# EAGLE board Pinscape Pico Expansion Board - DIY Friendly Main (EAGLE 7.7.0)
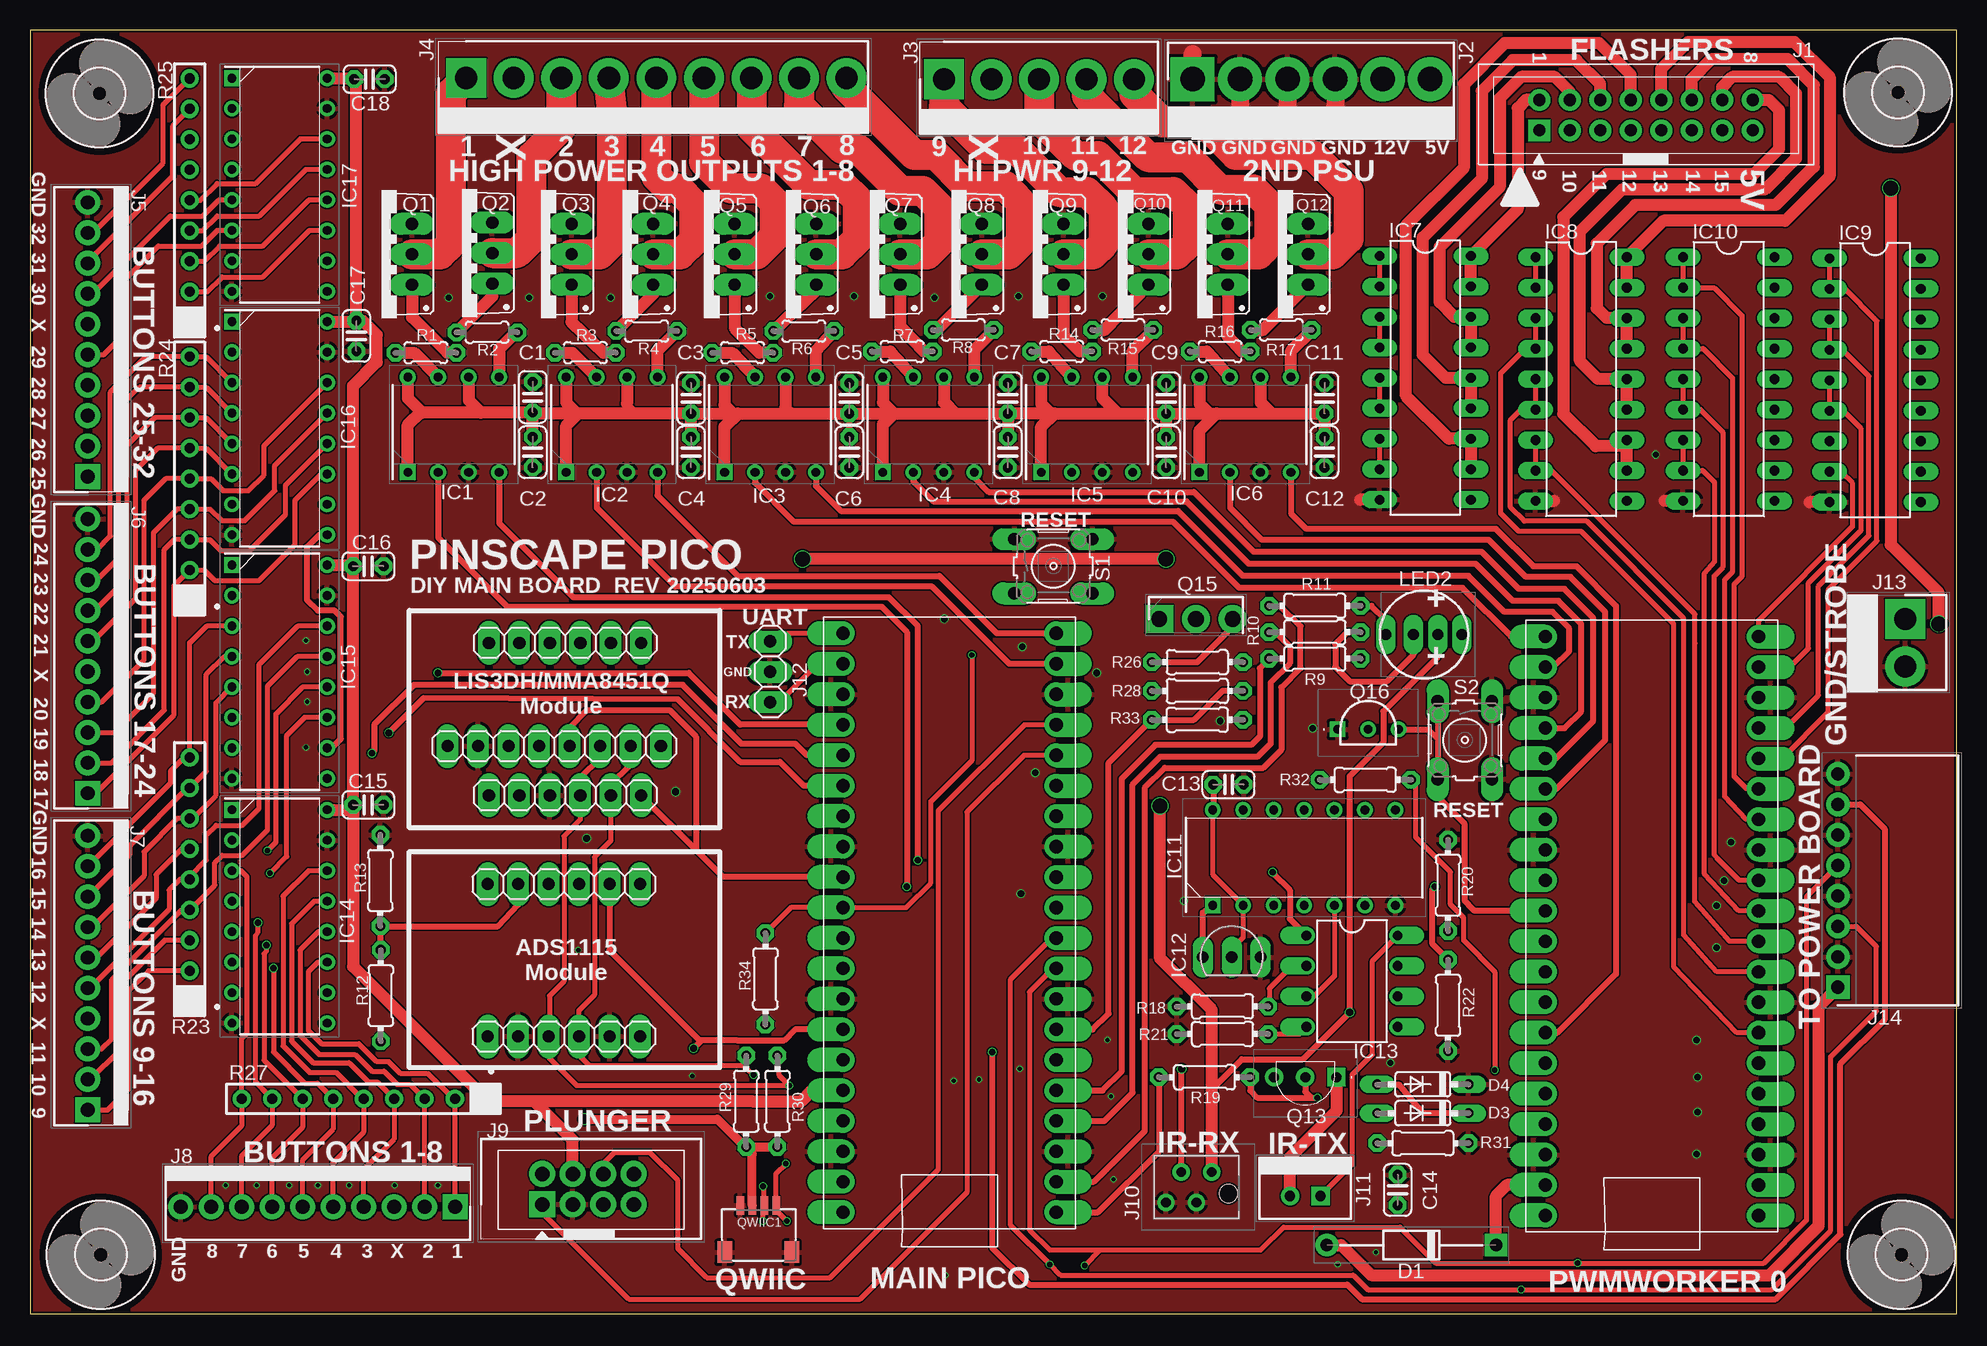
[diagram p11: board, top side]
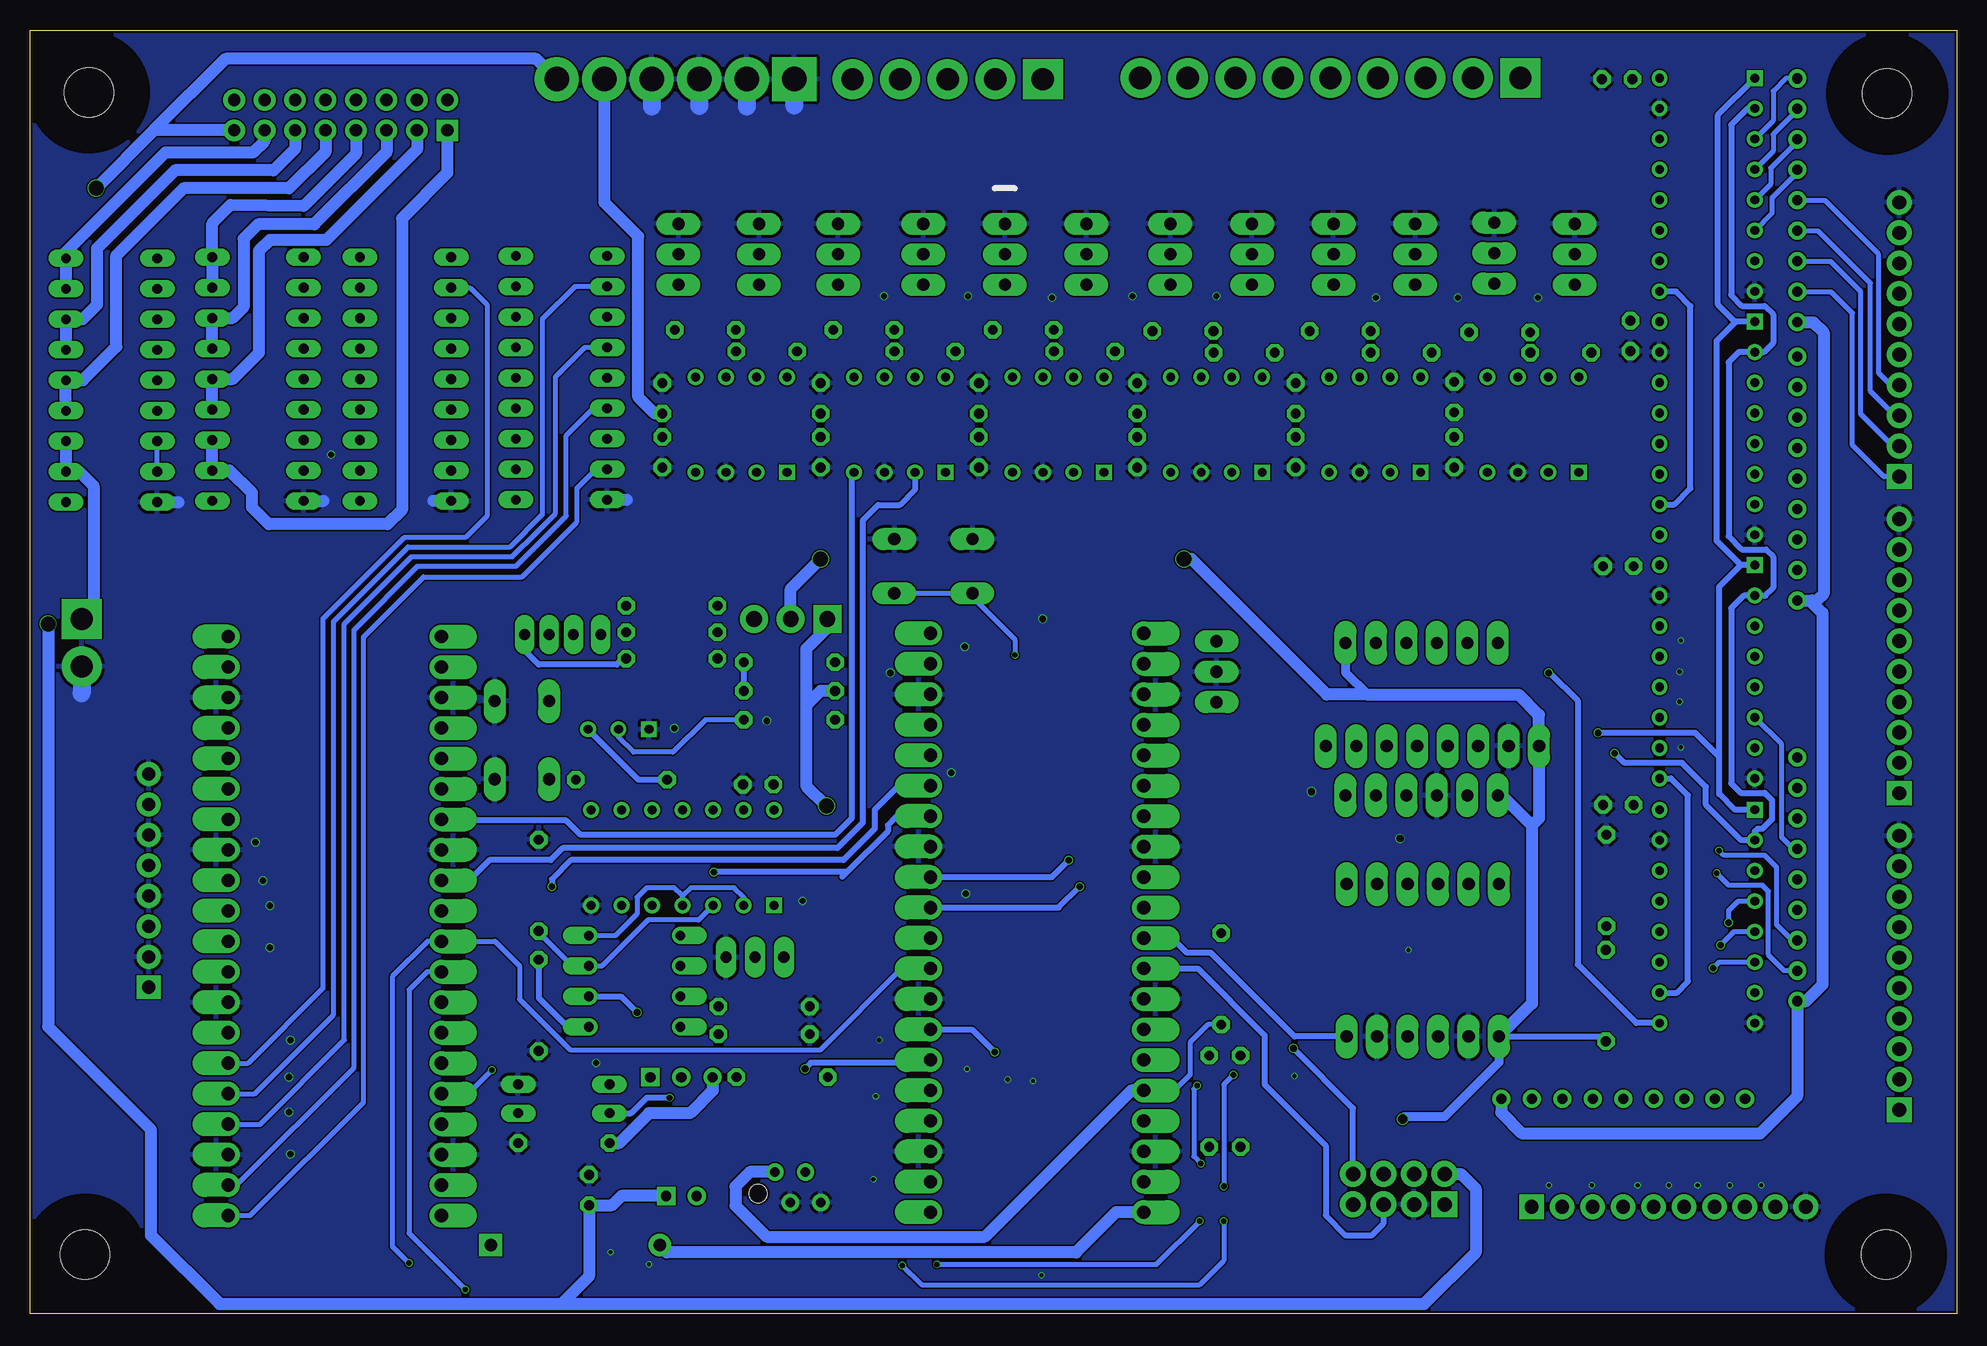
[diagram p12: board, bottom side, seen from below]

Size 160.6 x 107 mm. Coordinates in mm from the lower left corner, seen from the top.
Outline: 0,0 160.6,0 160.6,107 0,107 0,0
Copper layers (1*16): Top 0.035mm / dielectric 1.6mm / Bottom 0.035mm
Design rules "jlcpcb-2layers": minimum track width 5mil, minimum drill 0.3mm, track to track 5mil, track to pad 5mil, pad to pad 5mil, via to via 5mil, smd to smd 5mil, copper to edge 0.2mm, drill to drill 6mil, minimum pad ring 10mil, minimum via ring 3mil, stop-mask expansion 4mil, vias tented up to drill 0mil, thermal gap 10mil
Net classes: 1 highpower: width 0.305 mm, drill 0.483 mm

## Footprints (pad centres in the part's own frame; a part is rotated, then mirrored left to right if it is on the bottom)
C025-024X044 = drill 0.813 octagon: 1 -1.27,0; 2 1.27,0
DIOAD1408W86L464D236 = drill 1.05 pad 1.575 square: 1 0,0 | drill 1.05 pad 1.575: 2 14.1,0
DO35-7 = drill 0.813 long: A 3.81,0; C -3.81,0
DIP794W53P254L959H508Q8N = drill 0.73 pad 1.13 square: 1 -3.97,3.81 | drill 0.73 pad 1.13: 2 -3.97,1.27; 3 -3.97,-1.27; 4 -3.97,-3.81; 5 3.97,-3.81; 6 3.97,-1.27; 7 3.97,1.27; 8 3.97,3.81
DIL18 = drill 0.813 long: 1 -10.16,-3.81; 2 -7.62,-3.81; 3 -5.08,-3.81; 4 -2.54,-3.81; 5 0,-3.81; 6 2.54,-3.81; 7 5.08,-3.81; 8 7.62,-3.81; 9 10.16,-3.81; 10 10.16,3.81; 11 7.62,3.81; 12 5.08,3.81; 13 2.54,3.81; 14 0,3.81; 15 -2.54,3.81; 16 -5.08,3.81; 17 -7.62,3.81; 18 -10.16,3.81
DIP794W53P254L1930H508Q14N = drill 0.73 pad 1.13 square: 1 -3.97,7.62 | drill 0.73 pad 1.13: 2 -3.97,5.08; 3 -3.97,2.54; 4 -3.97,0; 5 -3.97,-2.54; 6 -3.97,-5.08; 7 -3.97,-7.62; 8 3.97,-7.62; 9 3.97,-5.08; 10 3.97,-2.54; 11 3.97,0; 12 3.97,2.54; 13 3.97,5.08; 14 3.97,7.62
TO-92_(TO-226) = drill 0.94 pad 1.118 long: 1 1.143,0; 2 -1.27,0; 3 -3.683,0
DIL08 = drill 0.813 offset: 1 -3.81,-3.81; 2 -1.27,-3.81; 3 1.27,-3.81; 4 3.81,-3.81; 5 3.81,3.81; 6 1.27,3.81; 7 -1.27,3.81; 8 -3.81,3.81
DIP794W53P254L1930H508Q16N = drill 0.73 pad 1.13 square: 1 -3.97,8.89 | drill 0.73 pad 1.13: 2 -3.97,6.35; 3 -3.97,3.81; 4 -3.97,1.27; 5 -3.97,-1.27; 6 -3.97,-3.81; 7 -3.97,-6.35; 8 -3.97,-8.89; 9 3.97,-8.89; 10 3.97,-6.35; 11 3.97,-3.81; 12 3.97,-1.27; 13 3.97,1.27; 14 3.97,3.81; 15 3.97,6.35; 16 3.97,8.89
3M-30316-6002HB-ROTATED = drill 1.01 pad 1.51: 1 -8.89,-1.27; 2 -8.89,1.27; 3 -6.35,-1.27; 4 -6.35,1.27; 5 -3.81,-1.27; 6 -3.81,1.27; 7 -1.27,-1.27; 8 -1.27,1.27; 9 1.27,-1.27; 10 1.27,1.27; 11 3.81,-1.27; 12 3.81,1.27; 13 6.35,-1.27; 14 6.35,1.27; 15 8.89,-1.27 | drill 1.01 pad 1.51 square: 16 8.89,1.27
SHDR6W183P0X396_1X6_2377X762X1 = drill 2.05 pad 3.075 square: 1 0,0 | drill 2.05 pad 3.075: 2 3.96,0; 3 7.92,0; 4 11.88,0; 5 15.84,0; 6 19.8,0
HDRV5W117P0X396_1X5_1981X762X1 = drill 1.85 pad 2.775 square: 1 7.92,0 | drill 1.85 pad 2.775: 2 3.958,0; 3 -0.004,0; 4 -3.966,0; 5 -7.928,0
SHDR9W117P0X396_1X9_3566X762X1 = drill 1.85 pad 2.775 square: 1 15.84,0 | drill 1.85 pad 2.775: 2 11.878,0; 3 7.916,0; 4 3.954,0; 5 -0.008,0; 6 -3.97,0; 7 -7.932,0; 8 -11.894,0; 9 -15.856,0
SHDR10W66P0X254_1X10_2540X572X = drill 1.15 pad 1.725 square: 1 11.43,0 | drill 1.15 pad 1.725: 2 8.89,0; 3 6.35,0; 4 3.81,0; 5 1.27,0; 6 -1.27,0; 7 -3.81,0; 8 -6.35,0; 9 -8.89,0; 10 -11.43,0
SHDR8W69P254_2X4_1780X878X955P = drill 1.2 pad 1.8 square: 1 0,0 | drill 1.2 pad 1.8: 2 0,2.54; 3 2.54,0; 4 2.54,2.54; 5 5.08,0; 6 5.08,2.54; 7 7.62,0; 8 7.62,2.54
2150794 = drill 0.8 pad 1.3: 1 0,0; 2 -1.27,-2.54; 3 -2.54,0; 4 -3.81,-2.54 | hole 1.5: 1.4,-1.8
HDRV2W66P0X254_1X2_762X572X100 = drill 0.85 pad 1.275 square: 1 1.27,0 | drill 0.85 pad 1.275: 2 -1.27,0
1X03 = drill 1.016 long: 1 -2.54,0; 2 0,0; 3 2.54,0
SHDR2W117P0X396_1X2_792X762X11 = drill 1.85 pad 2.775 square: 1 0,0 | drill 1.85 pad 2.775: 2 3.962,0
RHDRRA8W64P254_1X8_2083X851X24 = drill 1.1 pad 1.65 square: 1 0,0 | drill 1.1 pad 1.65: 2 -2.54,0; 3 -5.08,0; 4 -7.62,0; 5 -10.16,0; 6 -12.7,0; 7 -15.24,0; 8 -17.78,0
1X06 = drill 1.016 long: 1 -6.35,0; 2 -3.81,0; 3 -1.27,0; 4 1.27,0; 5 3.81,0; 6 6.35,0
1X08 = drill 1.016 long: 1 -8.89,0; 2 -6.35,0; 3 -3.81,0; 4 -1.27,0; 5 1.27,0; 6 3.81,0; 7 6.35,0; 8 8.89,0
5218559F = drill 0.91 pad 1.016 long: 1 0,1.27; 2 0,-0.762; 3 0,-2.794; 4 0,-5.08
RPI_PICO_TH_NO_DEBUG = drill 1.1 pad 1.6 offset: 3V3 8.89,13.97; 3V3_EN 8.89,16.51; ADC_VREF 8.89,11.43; AGND 8.89,6.35; GND@1 -8.89,19.05; GND@2 -8.89,6.35; GND@3 -8.89,-6.35; GND@4 -8.89,-19.05; GND@6 8.89,-19.05; GND@7 8.89,-6.35; GND@8 8.89,19.05; GP0 -8.89,24.13; GP1 -8.89,21.59; GP2 -8.89,16.51; GP3 -8.89,13.97; GP4 -8.89,11.43; GP5 -8.89,8.89; GP6 -8.89,3.81; GP7 -8.89,1.27; GP8 -8.89,-1.27; GP9 -8.89,-3.81; GP10 -8.89,-8.89; GP11 -8.89,-11.43; GP12 -8.89,-13.97; GP13 -8.89,-16.51; GP14 -8.89,-21.59; GP15 -8.89,-24.13; GP16 8.89,-24.13; GP17 8.89,-21.59; GP18 8.89,-16.51; GP19 8.89,-13.97; GP20 8.89,-11.43; GP21 8.89,-8.89; GP22 8.89,-3.81; GP26_A0 8.89,1.27; GP27_A1 8.89,3.81; GP28_A2 8.89,8.89; RUN 8.89,-1.27; VBUS 8.89,24.13; VSYS 8.89,21.59
TO220BV = drill 1.016 long: 1 -2.54,-2.54; 2 0,-2.54; 3 2.54,-2.54
BC33725 = drill 0.85 pad 1.381 square: 1 0,0 | drill 0.85 pad 1.381: 2 2.6,0; 3 5.2,0
TO229P300X760X1364-3P = drill 1.3 pad 1.95 square: 1 -0.762,0 | drill 1.3 pad 1.95: 2 2.29,0; 3 5.342,0
2N2222A = drill 0.72 pad 1.234 square: 1 0,0 | drill 0.72 pad 1.234: 2 2.54,0; 3 5.08,0
JST_SH4 = smd 0.6 x 1.55: 1 -1.5,2.514; 2 -0.5,2.514; 3 0.5,2.514; 4 1.5,2.514 | smd 1.2 x 1.8: MT1 -2.8,-1.386; MT2 2.8,-1.386
0204/5 = drill 0.813 pad 1.333 octagon: 1 -2.54,0; 2 2.54,0
0204/7 = drill 0.813 octagon: 1 -3.81,0; 2 3.81,0
4609X = drill 0.84 pad 1.34: 1 -10.16,0; 2 -7.62,0; 3 -5.08,0; 4 -2.54,0; 5 0,0; 6 2.54,0; 7 5.08,0; 8 7.62,0; 9 10.16,0
B3F-10XX = drill 1.016 long: 1 -3.251,2.261; 2 3.251,2.261; 3 -3.251,-2.261; 4 3.251,-2.261
4,1 = hole 4.1: 0,0

## Placement (x,y rotation side)
C1  100nF  [C025-024X044]  41.9,76.4 270 top
C2  4.7uF  [C025-024X044]  41.9,71.8 90 top
C3  100nF  [C025-024X044]  55.1,76.3 270 top
C4  4.7uF  [C025-024X044]  55.1,71.8 90 top
C5  100nF  [C025-024X044]  68.3,76.3 270 top
C6  4.7uF  [C025-024X044]  68.3,71.8 90 top
C7  100nF  [C025-024X044]  81.5,76.3 270 top
C8  4.7uF  [C025-024X044]  81.5,71.8 90 top
C9  100nF  [C025-024X044]  94.7,76.3 270 top
C10  4.7uF  [C025-024X044]  94.7,71.8 90 top
C11  100nF  [C025-024X044]  107.9,76.3 270 top
C12  4.7uF  [C025-024X044]  107.9,71.8 90 top
C13  100nF  [C025-024X044]  99.9,44.1 0 top
C14  4.7uF  [C025-024X044]  114,10.3 90 top
C15  100nF  [C025-024X044]  28.2,42.4 180 top
C16  100nF  [C025-024X044]  28.2,62.3 180 top
C17  100nF  [C025-024X044]  27.2,81.5 90 top
C18  100nF  [C025-024X044]  28.3,102.9 180 top
D1  SB140-T  [DIOAD1408W86L464D236]  122.2,5.7 180 top
D3  1N4148  [DO35-7]  116.1,16.7 180 top
D4  1N4148  [DO35-7]  116.1,19.1 180 top
IC1  UCC27524P  [DIP794W53P254L959H508Q8N]  35.3,74.1 90 top
IC2  UCC27524P  [DIP794W53P254L959H508Q8N]  48.5,74.1 90 top
IC3  UCC27524P  [DIP794W53P254L959H508Q8N]  61.7,74.1 90 top
IC4  UCC27524P  [DIP794W53P254L959H508Q8N]  74.9,74.1 90 top
IC5  UCC27524P  [DIP794W53P254L959H508Q8N]  88.1,74.1 90 top
IC6  UCC27524P  [DIP794W53P254L959H508Q8N]  101.3,74.1 90 top
IC7  ULN2803A  [DIL18]  116.3,78 270 top
IC8  ULN2803A  [DIL18]  129.3,77.9 270 top
IC9  ULN2803A  [DIL18]  153.8,77.8 270 top
IC10  ULN2803A  [DIL18]  141.6,77.9 270 top
IC11  SN74HC74NE4  [DIP794W53P254L1930H508Q14N]  106.2,38 90 top
IC12  S-80833CLY  [TO-92_(TO-226)]  98.9,29.7 180 top
IC13  PC827  [DIL08]  110.2,27.7 270 top
IC14  SN74HC165N  [DIP794W53P254L1930H508Q16N]  20.8,33.1 0 top
IC15  SN74HC165N  [DIP794W53P254L1930H508Q16N]  20.8,53.5 0 top
IC16  SN74HC165N  [DIP794W53P254L1930H508Q16N]  20.8,73.8 0 top
IC17  SN74HC165N  [DIP794W53P254L1930H508Q16N]  20.8,94.1 0 top
J1  30316-6002HBROTATED  [3M-30316-6002HB-ROTATED]  134.7,99.9 180 top
J2  640445-6  [SHDR6W183P0X396_1X6_2377X762X1]  96.9,102.9 0 top
J3  640445-5  [HDRV5W117P0X396_1X5_1981X762X1]  84.1,102.9 180 top
J4  640445-9  [SHDR9W117P0X396_1X9_3566X762X1]  52.2,103 180 top
J5  1-640456-0  [SHDR10W66P0X254_1X10_2540X572X]  4.8,81.2 270 top
J6  1-640456-0  [SHDR10W66P0X254_1X10_2540X572X]  4.8,54.8 270 top
J7  1-640456-0  [SHDR10W66P0X254_1X10_2540X572X]  4.8,28.4 270 top
J8  1-640456-0  [SHDR10W66P0X254_1X10_2540X572X]  24,8.9 0 top
J9  30308-6002HB  [SHDR8W69P254_2X4_1780X878X955P]  42.7,9.1 0 top
J10  215079-4  [2150794]  98.5,11.8 0 top
J11  640454-2  [HDRV2W66P0X254_1X2_762X572X100]  106.3,9.8 0 top
J12  [1X03]  61.7,53.5 270 top
J13  640445-2  [SHDR2W117P0X396_1X2_792X762X11]  156.3,57.9 270 top
J14  SSQ-108-02-T-S-RA  [RHDRRA8W64P254_1X8_2083X851X24]  150.7,27.2 270 top
JP1  [1X06]  44.6,55.9 0 top
JP2  [1X06]  44.6,43.2 0 top
JP3  [1X06]  44.5,35.8 0 top
JP4  [1X06]  44.5,23.1 0 top
JP5  [1X08]  43.7,47.3 0 top
LED2  521-8559F  [5218559F]  118.1,56.6 270 top
PICO1  [RPI_PICO_TH_NO_DEBUG]  76.65,32.57 180 top
PICO2  [RPI_PICO_TH_NO_DEBUG]  135.2,32.3 180 top
Q1  STP19NF20  [TO220BV]  29.3,88.3 90 top
Q2  FDPF085N10A  [TO220BV]  36,88.4 90 top
Q3  STP19NF20  [TO220BV]  42.6,88.3 90 top
Q4  STP19NF20  [TO220BV]  49.4,88.3 90 top
Q5  STP19NF20  [TO220BV]  56.2,88.3 90 top
Q6  STP19NF20  [TO220BV]  63,88.3 90 top
Q7  STP19NF20  [TO220BV]  70,88.3 90 top
Q8  STP19NF20  [TO220BV]  76.8,88.3 90 top
Q9  STP19NF20  [TO220BV]  83.6,88.3 90 top
Q10  STP19NF20  [TO220BV]  90.7,88.3 90 top
Q11  STP19NF20  [TO220BV]  97.3,88.3 90 top
Q12  STP19NF20  [TO220BV]  104,88.3 90 top
Q13  BC337-25  [BC33725]  108.9,19.7 180 top
Q15  2N5195G  [TO229P300X760X1364-3P]  94.9,57.9 0 top
Q16  2N2222A  [2N2222A]  109,48.7 0 top
QWIIC1  QWIIC  [JST_SH4]  60.7,6.5 0 top
R1  200R  [0204/5]  33,80.1 0 top
R2  200R  [0204/5]  38.1,81.8 180 top
R3  200R  [0204/5]  46.3,80.1 0 top
R4  200R  [0204/5]  51.4,81.9 180 top
R5  200R  [0204/5]  59.4,80.1 0 top
R6  200R  [0204/5]  64.5,81.9 180 top
R7  200R  [0204/5]  72.7,80.2 0 top
R8  200R  [0204/5]  77.8,82 180 top
R9  100R  [0204/7]  107.1,54.6 0 top
R10  10R  [0204/7]  107.1,56.8 0 top
R11  10R  [0204/7]  107.1,59 0 top
R12  10K  [0204/7]  29.24,26.5 270 top
R13  10K  [0204/7]  29.2,36.1 270 top
R14  200R  [0204/5]  86,80.2 0 top
R15  200R  [0204/5]  91.1,82 180 top
R16  200R  [0204/5]  99.2,80.2 0 top
R17  200R  [0204/5]  104.3,82 180 top
R18  240R  [0204/7]  99.4,25.6 0 top
R19  540R  [0204/7]  97.9,19.7 0 top
R20  10K  [0204/7]  118.2,35.7 90 top
R21  360R  [0204/7]  99.4,23.3 0 top
R22  10K  [0204/7]  118.2,25.7 90 top
R23  4609X-101-103F  [4609X]  13.3,36.2 90 top
R24  4609X-101-103F  [4609X]  13.3,69.6 90 top
R25  4609X-101-103F  [4609X]  13.3,92.8 90 top
R26  1K  [0204/7]  97.3,54.3 180 top
R27  4609X-101-103F  [4609X]  27.8,17.9 180 top
R28  22K  [0204/7]  97.3,51.9 180 top
R29  15K  [0204/7]  59.7,17.7 270 top
R30  15K  [0204/7]  62.3,17.7 270 top
R31  2R5  [0204/7]  116.1,14.2 180 top
R32  4.7K  [0204/7]  111.3,44.5 0 top
R33  2.2k  [0204/7]  97.3,49.5 0 top
R34  4.7K  [0204/7]  61.3,27.9 270 top
S1  B3F-1000  [B3F-10XX]  85.3,62.3 0 top
S2  B3F-1000  [B3F-10XX]  119.6,47.8 270 top
U$1  [4,1]  5.8,101.7 0 top
U$2  [4,1]  155.7,101.8 0 top
U$3  [4,1]  156,4.9 0 top
U$4  [4,1]  5.9,4.9 0 top

## Tracks (layer width: path | path; a pad name or v marks a point on that pad's centre or on a via)
3V3_PERIPHERAL  (via drill 0.8, 1.25)
  Top 0.5: R29.2 59.65,13.85
  Top 0.75: v46.2,16.2 57.3,16.2 59.65,13.85 60.2,13.3 QWIIC1.2 | R29.2 R30.2
  Top 1: v94.7,62.9 v64.4,62.9
  Bottom 0.5: JP4.1 29.65,23.1 R12.2
  Bottom 0.75: JP4.1 38.15,20.95 42.7,16.4 46,16.4 v46.2,16.2 | JP1.6 50.95,53.45 49.1,51.6
  Bottom 1: JP2.1 37.9,43.2 35.4,40.7 | 35.4,40.7 35.4,25.85 JP4.1 | Q15.2 97.19,60.41 v94.7,62.9 | v64.4,62.9 63.8,62.9 52.5,51.6 49.1,51.6 36.5,51.6 34.81,49.91 JP5.1 34.81,41.29 35.4,40.7
3V3_PICO  (via drill 0.6, 1.25)
  Top 0.4: 60.2,17.7 59.8,17.7
  Top 0.5: 98.5,18.7 101,21.2 106.1,21.2 v110,25.1 110,44.8 112.8,47.6 112.8,50.2 117.34,54.74 LED2.2 | C17.2 27.73,82.77
  Top 1: 42,17.7 60.2,17.7 64.3,17.7 65.2,18.6 PICO1.3V3 | 42,17.7 38.16,17.7 R27.1 26.93,28.93 C15.2 | IC14.16 26.78,41.99 C15.2 | J10.1 98.5,18.7 98.5,25.3 94.2,29.6 v94.2,42.3 | J9.4 45.24,14.46 42,17.7 | IC15.16 26.78,62.39 C16.2 | C16.2 26.93,77.33 28.9,79.3 28.9,81.6 27.73,82.77 | IC16.16 27.12,82.69 C17.2 27.2,102.73 C18.2 27.08,102.99 IC17.16 | C15.2 C16.2
  Bottom 0.4: R34.2 62.41,24.09 63.9,22.6 63.9,19.9 65.2,18.6 PICO1.3V3
  Bottom 0.5: IC13.6 111.33,26.43 v110,25.1
  Bottom 1: R27.1 37.96,16.76 36.2,15 16.4,15 13.3,18.1 R23.1 12.56,26.04 11.2,27.4 11.2,58.4 12.07,59.27 12.07,59.44 | R25.1 11.94,82.64 11.1,81.8 11.1,60 11.66,59.44 12.07,59.44 | R24.1 12.07,59.44 | Q15.1 94.2,57.84 94.2,57.1 95.9,55.4 95.9,50.7 | 95.9,50.7 95.9,44 v94.2,42.3 | R28.2 94.7,51.9 95.9,50.7 | J10.1 100.6,11.8 101.8,10.6 101.8,9 99.2,6.4 81,6.4 68.8,18.6 PICO1.3V3
5V  (via drill 1.25)
  Top 0.4: IC11.14 98.58,36.62 101.12,34.08 IC11.2 101.12,31.32 100.17,30.37 IC12.2 | IC13.8 111.9,29.4 111.9,21.6 110.2,19.9 110.2,12.43 J11.1
  Top 0.5: C13.1 98.63,42.02 IC11.14
  Top 1: v155.1,93.8 155.1,64.1 159.1,60.1 v159.1,57.5
  Bottom 0.4: 106.2,34.8 106.9,35.5 109.2,35.5 110,34.7 110,33.3 111.79,31.51 IC13.8 | IC11.4 106.2,34.8 | IC11.2 101.12,34.72 101.9,35.5 105.5,35.5 106.2,34.8
  Bottom 1: J1.2 150.27,98.63 | v159.1,57.5 159.1,23.9 150.5,15.3 150.5,6.5 144.8,0.8 116.3,0.8 | J9.2 41.34,11.64 40.1,10.4 40.1,5.1 44.4,0.8 116.3,0.8 | 150.27,98.63 v155.1,93.8 | J11.1 111.3,9.8 112.07,9.03 C14.1 114,3.1 116.3,0.8 | 150.27,98.63 144.3,104.6 118.4,104.6 J2.6
12V
  Top 0.406: 41.87,75.1 C1.2 | 41.87,73.1 C2.2
  Top 0.5: 32.69,75.1 32.59,75.19 | 45.7,75.03 45.6,75.03 | 42,75.03 C1.2 | 49.77,75.86 50.6,75.03 | 58.6,75.03 59,75.03 | C6.2 C5.2 | 62.97,75.56 63.5,75.03
  Top 1: IC1.8 31.49,76.3 32.59,75.19 31.49,74.09 IC1.1 | 37.6,75.1 41.87,75.1 41.87,73.1 | 37.6,75.1 32.69,75.1 | C3.2 50.6,75.03 45.7,75.03 44.69,74.02 IC2.1 | 42,75.03 45.6,75.03 44.69,75.94 IC2.8 | IC1.6 36.57,76.13 37.6,75.1 | IC2.6 49.77,75.86 | C4.2 C3.2 | C3.2 58.6,75.03 57.89,75.74 IC3.8 | 72,75.03 C5.2 63.5,75.03 59,75.03 57.89,73.92 IC3.1 | 72,75.03 77.1,75.03 | C7.2 C8.2 | IC4.6 76.17,75.96 77.1,75.03 | IC4.8 71.09,75.94 72,75.03 | IC3.6 62.97,75.56 | IC4.1 71.09,74.12 72,75.03 | 85.1,75.03 85.4,75.03 | 85.4,75.03 90.7,75.03 | 90.7,75.03 C9.2 | C9.2 C10.2 | IC5.6 89.37,76.36 90.7,75.03 | IC5.8 84.29,75.84 85.1,75.03 | IC5.1 84.29,73.92 85.4,75.03 | C9.2 98.3,75.03 | 98.3,75.03 98.9,75.03 | 98.9,75.03 103.5,75.03 | 103.5,75.03 C11.2 C12.2 | IC6.8 97.49,75.84 98.3,75.03 | IC6.6 102.57,75.96 103.5,75.03 | IC6.1 97.49,73.62 98.9,75.03 | 77.1,75.03 C7.2 | 85.1,75.03 C7.2
  Bottom 1: C11.2 108.53,75.03 109.9,76.4 109.9,89.8 112.74,92.64 J2.5
$N377  (via drill 0.5)
  Top 0.5: R19.2 101.71,18.59 102.3,18 106.8,18 | 106.8,18 v107.3,18 | Q13.2 106.3,18.5 106.8,18
  Bottom 0.5: D3.A 110.5,16.7 109.2,18 v107.3,18
/PERIPHERAL_POWER_ENABLE  (via drill 0.55)
  Top 0.5: R28.1 99.4,51.9 97,49.5 R33.1 89.9,45.91 89.9,25 88.58,23.68 PICO1.GP5 | v80.2,21.8 80.2,5.5 83.3,2.4 109.8,2.4 111,1.2 145.5,1.2 150.9,6.6 150.9,20.8 154.6,24.5 154.6,40.4 152.56,42.44 J14.7
  Bottom 0.5: R26.1 R28.1 | PICO1.GP5 82.08,23.68 v80.2,21.8
ACCEL_INTR
  Top 0.5: 55.5,38.65 JP2.6 | PICO1.GP22 67.74,36.4 57.75,36.4 55.5,38.65 | JP5.5 44.97,48.87 46.4,50.3 53.3,50.3 55.5,48.1 55.5,38.65
ADC_INTR
  Bottom 0.5: JP4.6 55.2,23.1 62.2,30.1 64.2,30.1 65.4,31.3 PICO1.GP26_A0
BUTTON1
  Top 0.4: J8.1 R27.2 35.3,17.9 33.2,20 30.9,20 29.9,21 28.9,21 27.4,22.5 24.3,22.5 23.2,23.6 23.2,28.5 23.99,29.29 IC14.11
BUTTON2
  Top 0.4: J8.2 R27.3 31.68,19.1 30.6,19.1 29.5,20.2 28.5,20.2 27.1,21.6 24.1,21.6 22.5,23.2 22.5,30.3 24.03,31.83 IC14.12
BUTTON3
  Top 0.4: J8.4 27.81,12.01 30.34,14.54 R27.4 28.94,19.3 28.2,19.3 26.6,20.9 23.6,20.9 21.8,22.7 21.8,32.5 23.67,34.37 IC14.13
BUTTON4
  Top 0.4: J8.5 25.27,12.57 27.8,15.1 R27.5 27.7,17.9 25.5,20.1 24.7,20.1 24.4,20.1 23.3,20.1 21.1,22.3 21.1,34.8 23.21,36.91 IC14.14
BUTTON5  (via drill 0.55)
  Top 0.4: J8.6 22.73,12.83 25.26,15.36 R27.6 23.96,19.2 22.9,19.2 20.3,21.8 v20.3,28.8
  Bottom 0.4: IC14.6 19.81,29.29 v20.3,28.8
BUTTON6  (via drill 0.55)
  Top 0.4: J8.7 20.19,12.99 22.72,15.52 R27.7 19.5,21.12 19.5,30 19.7,30.2 v19.7,30.7
  Bottom 0.4: IC14.5 18.57,31.83 v19.7,30.7
BUTTON7  (via drill 0.55)
  Top 0.4: J8.8 17.65,13.15 20.18,15.68 R27.8 19.3,18.78 19.3,18.8 18.8,19.3 18.8,31.5 19,31.8 v19,32.6
  Bottom 0.4: v19,32.6 19,33.6 18.23,34.37 IC14.4
BUTTON8
  Top 0.4: J8.9 15.11,13.11 17.64,15.64 R27.9 17.64,22.94 18.1,23.4 18.1,36.4 17.59,36.91 IC14.3
BUTTON9  (via drill 0.45)
  Top 0.4: J7.1 6.47,16.97 8.2,18.7 8.2,26.9 9.88,28.58 R23.2 | v20,36.7 21.4,38.1 21.4,48.2 22.89,49.69 IC15.11
  Bottom 0.4: R23.2 14.38,28.58 15.7,29.9 15.7,35.2 16.2,35.7 19,35.7 v20,36.7
BUTTON10  (via drill 0.45)
  Top 0.4: J7.2 5.01,19.51 7.5,22 7.5,27.4 11.22,31.12 R23.3 | v19.8,38.6 20.5,39.3 20.5,50 22.73,52.23 IC15.12
  Bottom 0.4: R23.3 13.72,31.12 15,32.4 15,37.2 16,38.2 19.4,38.2 v19.8,38.6
BUTTON11
  Top 0.4: J7.3 5.95,22.05 6.8,22.9 6.8,27.8 12.66,33.66 R23.4 13.36,33.66 15.4,35.7 15.4,37.6 16,38.2 17.7,38.2 19.8,40.3 19.8,52.3 22.27,54.77 IC15.13
BUTTON12
  Top 0.4: J7.5 5.03,27.13 11.6,33.7 11.6,35.3 12.5,36.2 R23.5 13.3,36.4 14.7,37.8 14.7,39.9 15.5,40.7 17.7,40.7 19.1,42.1 19.1,54.1 22.31,57.31 IC15.14
BUTTON13
  Top 0.4: J7.6 5.57,29.67 10.5,34.6 10.5,36.6 12.64,38.74 R23.6
  Bottom 0.4: R23.6 13.64,38.74 14.6,39.7 14.6,47.46 IC15.6
BUTTON14
  Top 0.4: J7.7 5.21,32.21 9.5,36.5 9.5,38.5 12.28,41.28 R23.7 13.58,41.28 15.5,43.2 15.5,50.9 IC15.5
BUTTON15
  Top 0.4: 4.8,34.9 J7.8 8.3,38.25 8.3,39 13.12,43.82 R23.8 13.32,43.82 14.7,45.2 14.7,53.3 16.17,54.77 IC15.4
BUTTON16
  Top 0.4: J7.9 11.7,44.19 11.7,45.2 12.86,46.36 R23.9 13.3,55.9 14.71,57.31 IC15.3
BUTTON17
  Top 0.4: IC16.11 24.29,69.99 22.1,67.8 22.1,64.1 19.1,61.1 15.4,61.1 14.52,61.98 R24.2 12,60.68 12,49.9 5.47,43.37 J6.1
BUTTON18
  Top 0.4: J6.2 6.81,45.91 11.2,50.3 11.2,63.7 12.02,64.52 R24.3 14.98,64.52 15.9,63.6 18.3,63.6 21.3,66.6 21.3,69.06 IC16.12
BUTTON19
  Top 0.4: J6.3 7.05,48.45 10.3,51.7 10.3,65.1 12.26,67.06 R24.4 15.04,67.06 16,66.1 17.9,66.1 20.4,68.6 20.4,70.7 IC16.13
BUTTON20
  Top 0.4: J6.4 5.99,50.99 9.5,54.5 9.5,67.8 11.3,69.6 R24.5 15.1,69.6 16.1,68.6 18.2,68.6 19.5,69.9 19.5,72.34 IC16.14
BUTTON21
  Top 0.4: J6.6 5.27,56.07 8.8,59.6 8.8,70.3 10.64,72.14 R24.6 14.68,72.14 IC16.6
BUTTON22
  Top 0.4: J6.7 5.41,58.61 8.1,61.3 8.1,72.4 10.38,74.68 R24.7 14.68,74.68 IC16.5
BUTTON23
  Top 0.4: J6.8 5.55,61.15 7.4,63 7.4,75.5 9.12,77.22 R24.8 14.68,77.22 IC16.4
BUTTON24
  Top 0.4: J6.9 5.59,63.69 6.7,64.8 6.7,76.8 9.66,79.76 R24.9 14.68,79.76 IC16.3
BUTTON25
  Top 0.4: R25.2 14.78,85.18 16,86.4 19.4,86.4 23.29,90.29 IC17.11
  Bottom 0.4: J5.1 6.07,69.77 8.7,72.4 8.7,83.4 10,84.7 10.3,85 10.48,85.18 R25.2
BUTTON26
  Top 0.4: R25.3 14.52,87.72 15.8,89 19.4,89 23.23,92.83 IC17.12
  Bottom 0.4: J5.2 5.31,72.31 8,75 8,85.2 10.52,87.72 R25.3
BUTTON27
  Top 0.4: R25.4 14.36,90.26 15.6,91.5 19.1,91.5 22.97,95.37 IC17.13
  Bottom 0.4: J5.3 5.15,74.85 7.2,76.9 7.2,85.9 11.56,90.26 R25.4
BUTTON28
  Top 0.4: R25.5 14.2,92.8 15.6,94.2 18.8,94.2 22.51,97.91 IC17.14
  Bottom 0.4: J5.4 5.49,77.39 6.5,78.4 6.5,88.3 11,92.8 R25.5
BUTTON29
  Top 0.4: J5.5 6.13,79.93 7.3,81.1 7.3,85.6 10.7,89 14.3,89 15.59,90.29 IC17.6
  Bottom 0.4: R25.6 13.3,95.1 15.4,93 15.4,91.72 IC17.6
BUTTON30
  Top 0.4: J5.7 5.21,85.01 11.7,91.5 14.4,91.5 15.73,92.83 IC17.5
  Bottom 0.4: R25.7 13.3,97.7 15.5,95.5 15.5,94.16 IC17.5
BUTTON31
  Top 0.4: J5.8 4.8,87.7 11.9,94.8 11.9,99.02 R25.8
  Bottom 0.4: R25.8 13.3,100.3 15.3,98.3 15.3,96.9 IC17.4
BUTTON32
  Top 0.4: J5.9 5.29,90.09 11.1,95.9 11.1,100.76 R25.9
  Bottom 0.4: R25.9 14.24,102.96 15.3,101.9 15.3,99.44 IC17.3
BUTTON_CLK  (via drill 0.55)
  Top 0.5: PICO1.GP19 64.76,46.54 63.8,47.5 59.3,47.5 54.4,52.4 32,52.4 28.7,49.1 28.7,46.9 v28.5,46.7
  Bottom 0.5: IC17.2 17.45,100.45 18.8,99.1 18.8,84.9 17.9,84 16,84 15.3,83.3 15.3,80.9 16.05,80.15 IC16.2 18.15,80.15 19,79.3 19,64.8 17.9,63.7 15.9,63.7 15.3,63.1 15.3,60.5 15.95,59.85 IC15.2 17.75,59.85 18.8,58.8 18.8,44.2 18,43.4 16,43.4 15.4,42.8 15.4,41.2 16.2,40.4 16.6,40.4 16.83,40.17 IC14.2 17.95,39.45 20.9,42.4 20.9,43.9 22.9,45.9 27.7,45.9 v28.5,46.7
BUTTON_DATA  (via drill 0.55)
  Top 0.5: PICO1.GP18 67.74,49.1 59.2,49.1 54.9,53.4 v34,53.4
  Bottom 0.5: IC14.9 26.71,24.21 31.6,29.1 31.6,51.1 33.9,53.4 v34,53.4
BUTTON_SHLD  (via drill 0.55)
  Top 0.5: PICO1.GP20 64.5,44 62.5,46 59.2,46 54,51.2 32.8,51.3 v29.9,48.4
  Bottom 0.5: IC14.1 18.49,41.99 19.8,43.3 19.8,46.4 | 19.8,46.4 19.8,60.6 18.1,62.3 | 18.1,62.3 18.01,62.39 IC15.1 | 18.1,62.3 18.1,62.5 20,64.4 20,81.1 18.5,82.6 | 18.5,82.6 18.41,82.69 IC16.1 | 18.5,82.6 18.5,82.7 19.9,84.1 19.9,99.92 IC17.1 | 19.8,46.4 21.8,48.4 v29.9,48.4
FLASHCTL1
  Top 0.4: IC7.1 IC7.2
  Bottom 0.4: IC7.2 115.18,85.62 117.9,82.9 117.9,66.6 120.6,63.9 129.1,63.9 135.3,57.7 135.3,24.9 141.87,18.33 PICO2.GP3
FLASHCTL2
  Top 0.4: IC7.3 IC7.4
  Bottom 0.4: PICO2.GP2 141.41,15.79 134.4,22.8 134.4,57.5 128.8,63.1 120.4,63.1 118.3,65.2 117.6,65.9 116.8,66.7 116.8,78.1 114.36,80.54 IC7.4
FLASHCTL3
  Top 0.4: IC7.5 IC7.6
  Bottom 0.4: PICO2.GP1 143.39,10.71 133.6,20.5 133.6,57 128.3,62.3 120.1,62.3 117.9,64.5 117.65,64.75 115.9,66.5 115.9,73.2 113.64,75.46 IC7.6
FLASHCTL4
  Top 0.4: IC7.7 IC7.8
  Bottom 0.4: PICO2.GP0 142.23,8.17 132.8,17.6 132.8,56.4 127.8,61.4 119.6,61.4 115,66 115,68.8 113.4,70.4 112.51,70.4 IC7.8
FLASHCTL5
  Top 0.4: IC8.1 IC8.2
  Bottom 0.4: IC8.2 123.92,85.52 122.5,84.1 122.5,66.5 124.3,64.7 129.4,64.7 136.2,57.9 136.2,27.1 142.43,20.87 PICO2.GP4
FLASHCTL6
  Top 0.4: IC8.3 IC8.4 124.64,80.44 122.6,78.4 122.6,66.7 124.1,65.2 129.3,65.2 137,57.5 137,28.9 142.29,23.41 PICO2.GP5
FLASHCTL7
  Top 0.4: IC8.5 IC8.6 124.26,75.36 123.4,74.5 123.4,67.2 124.55,66.05 129.75,66.05 137.85,57.95 137.85,31.56 140.62,28.49 PICO2.GP6
FLASHCTL8
  Top 0.4: IC8.7 IC8.8 126.82,70.28 138.79,58.31 138.79,55.87 138.75,34.35 141.67,31.03 PICO2.GP7
FLASHCTL9
  Top 0.4: IC10.7 IC10.8 139.42,70.28 140.4,69.3 140.4,62.67 139.58,61.75 139.58,36.63 142.44,33.57 PICO2.GP8
FLASHCTL10
  Top 0.4: IC10.5 IC10.6 139.24,75.36 141.1,73.5 141.1,62.2 140.39,61.49 140.39,38.27 140.64,37.92 140.66,37.92 142.47,36.11 PICO2.GP9
FLASHCTL11
  Top 0.4: IC10.3 IC10.4 139.46,80.44 141.9,78 141.9,61.83 141.25,61.18 141.25,43.1 143.06,41.19 PICO2.GP10
FLASHCTL12
  Top 0.4: IC10.1 IC10.2 140.38,85.52 142.7,83.2 142.7,61.45 142.06,60.81 142.06,44.77 143.1,43.73 PICO2.GP11
FLASHCTL13
  Top 0.4: IC9.5 IC9.6 151.13,75.26 152.63,73.76 152.63,65.31 148.23,60.91 148.23,55.44 146.68,53.89 PICO2.GP14
FLASHCTL14
  Top 0.4: IC9.3 IC9.4 151.07,80.34 153.28,78.13 153.28,64.84 149.08,60.64 149.08,51.53 146.36,48.81 PICO2.GP13
FLASHCTL15
  Top 0.4: IC9.1 IC9.2 151.27,85.42 153.94,82.75 153.94,64.4 149.91,60.37 149.91,50.13 146.05,46.27 PICO2.GP12
FLASHCTL16
  Top 0.4: IC9.8 150.05,70.12 151.02,70.12 151.93,69.21 151.93,65.59 151.89,65.59 144.09,57.79 PICO2.GP15
  Bottom 0.4: IC9.8 IC9.7
FLASHER1
  Top 1: IC7.18 | IC7.17 IC7.18 | J1.15 124.67,101.17 124,100.5 124,92.05 IC7.18
FLASHER2
  Top 1: IC7.15 IC7.16 120.09,83.1 118.7,83.1 117.5,84.3 117.5,88.9 122.5,93.9 122.5,101.3 124.3,103.1 127.1,103.1 128.35,101.85 J1.13
FLASHER3
  Top 1: IC7.13 IC7.14 118,78 116.1,79.9 116.1,89.7 121,94.6 121,101.9 123.6,104.5 128.9,104.5 130.89,102.51 J1.11
FLASHER4
  Top 1: IC7.11 IC7.12 118.28,72.92 114.7,76.5 114.7,90.7 119.5,95.5 119.5,102.5 122.9,105.9 130.8,105.9 133.43,103.27 J1.9
FLASHER5
  Top 1: IC8.17 IC8.18 | IC8.18 133.16,88.06 | IC8.18 136.15,91.1 146.3,91.1 150,94.8 150,103.1 147.1,106 138.2,106 135.97,103.77 J1.7
FLASHER6
  Top 1: IC8.15 IC8.16 131.42,82.98 130.6,83.8 130.6,89.2 133.8,92.4 145.5,92.4 148.7,95.6 148.7,102.4 146.5,104.6 140.2,104.6 138.51,102.91 J1.5
FLASHER7
  Top 1: IC8.13 IC8.14 130.7,77.9 129.2,79.4 129.2,90.2 132.7,93.7 144.6,93.7 147.2,96.3 147.2,101.7 145.8,103.1 141.9,103.1 141.05,102.25 J1.3
FLASHER8
  Top 1: IC8.11 133.11,72.3 | 133.11,72.3 IC8.12 | 133.11,72.3 130.5,72.3 127.8,75 127.8,91.4 131.4,95 143.7,95 145.8,97.1 145.8,100.3 144.93,101.17 J1.1
FLASHER9
  Bottom 1: IC10.11 IC10.12 | IC10.11 145.48,70.28 | IC10.11 143.98,70.28 142.1,68.4 142.1,67.2 140.7,65.8 130.8,65.8 129.6,67 129.6,91.3 125.81,95.09 J1.16
FLASHER10
  Bottom 1: IC10.13 IC10.14 143.7,77.9 141.5,80.1 141.5,88.6 140.6,89.5 135.9,89.5 128.35,97.05 J1.14
FLASHER11
  Bottom 1: IC10.15 IC10.16 143.72,82.98 142.8,83.9 142.8,89.6 141.6,90.8 136.9,90.8 130.89,96.81 J1.12
FLASHER12
  Bottom 1: IC10.17 IC10.18 145.41,90.89 143.9,92.4 137.8,92.32 133.43,96.69 J1.10
FLASHER13
  Bottom 1: IC9.13 IC9.14 156.2,77.8 153.4,80.6 153.4,88.2 147.8,93.8 139,93.8 135.97,96.83 J1.8
FLASHER14
  Bottom 1: IC9.15 IC9.16 156.22,82.88 155,84.1 155,88.8 148.5,95.3 140.3,95.3 138.51,97.09 J1.6
FLASHER15
  Bottom 1: IC9.17 IC9.18 157.61,88.49 149.3,96.8 142,96.8 141.05,97.75 J1.4
FLASHER16
  Bottom 1: IC9.12 IC9.11 156.48,70.18 155.3,69 155.3,58.9 J13.1
GND  (via drill 0.35, 0.5, 0.55, 0.6)
  Top 1: IC7.9 110.86,67.84 | IC8.9 127.06,67.74 | IC9.9 148.34,67.64 | IC10.9 136.24,67.74
  Top 1.5: J2.1 96.9,105 | J2.2 100.86,100.84 | J2.3 104.82,100.72 | J2.4 108.8,100.6
  Bottom 1: IC7.9 110.86,67.84 | IC8.9 126.96,67.74 | IC10.9 136.16,67.74 | IC9.9 148.24,67.64
  Bottom 1.5: J2.1 96.9,100.7 | J2.2 100.86,100.64 | J2.3 104.82,100.68 | J2.4 108.78,100.62 | J13.2 156.3,51.7
  other vias: 34.9,84.7 41.6,84.7 48.4,84.7 61.7,84.8 75.4,84.7 113.4,20.9 89.4,84.8 68.7,84.8 82.4,84.8 135.5,71.6 96.2,34.4 106.9,48.8 82.7,55.6 88.9,53.4 99.2,49.4 76.2,57.9 82.6,35 83.8,45.1 112.2,5.1 138.9,13.3 139,16.8 139,19.7 138.9,22.8 82.5,20.4 77,19.4 79.1,19.5 76.3,3.2 109,4.1 30.4,10.7 26.6,10.7 24,10.7 21.6,10.7 18.9,10.7 16.3,10.7 34,10.7 45.7,30.3 55.2,19.8 23,56.1 23.1,53.5 23.1,51 23,47.2 89.8,22.8 90.1,18.1 90.3,11.2 140.6,30.5 140.6,34 141.8,39.3 141.2,36.1 53.8,43.5 46.4,39.6
  pour Top: 0.2,106.8 160.7,106.8 160.7,-0.2 0.2,-0.2
  pour Bottom: 0.2,106.8 160.6,106.7 160.6,0.2 0.2,0.2
IR_IN  (via drill 0.6)
  Top 0.5: J10.3 95.96,20.36 v96,20.4
  Bottom 0.5: v96,20.4 95.5,20.9 85.78,20.9 PICO1.GP4
IR_LED_CATHODE
  Top 1: Q13.1 108.9,16.9 105.03,13.03 J11.2
IR_OUT
  Top 0.5: PICO1.GP0 89.04,8.44 94.09,13.49 R19.1
LED_B
  Top 0.5: R10.1 103.8,56.8 105,55.6 105,54.2 103.4,52.6 103.4,47.5 102.3,46.4 94.2,46.4 91.9,44.1 91.9,18.4 89.56,16.06 PICO1.GP2
LED_G
  Top 0.5: R11.1 104.2,59 105.9,57.3 105.9,53.8 104.3,52.2 104.3,47 102.8,45.5 94.6,45.5 92.9,43.8 92.9,15.2 88.68,10.98 PICO1.GP1
LED_R
  Top 0.5: R9.1 102.5,53.81 102.5,48.1 101.8,47.4 93.8,47.4 91,44.6 91,20.2 89.4,18.6 PICO1.GP3
N$1
  Top 1: R1.1 32,80.1 IC1.7
N$2
  Top 1: R2.1 40.5,81.8 39.1,80.4 IC1.5
N$3
  Top 1: R1.2 34.8,80.1 31.84,83.06 Q1.1
N$4
  Top 1: R2.2 38.54,84.78 Q2.1
N$5
  Top 1: R3.1 45.2,80.1 IC2.7
N$6
  Top 1: IC2.5 52.31,80.27 R4.1
N$7
  Top 1: R3.2 47.8,80.1 45.14,82.66 Q3.1
N$8
  Top 1: R4.2 51.94,84.98 Q4.1
N$9
  Top 1: R5.1 58.5,80.1 IC3.7
N$10
  Top 1: IC3.5 65.51,80.27 R6.1
N$11
  Top 1: R5.2 60.8,80.1 58.74,82.16 Q5.1
N$12
  Top 1: Q6.1 65.54,85.28 R6.2
N$13
  Top 1: R7.1 71.7,80.2 IC4.7
N$14
  Top 1: IC4.5 78.71,80.37 R8.1
N$15
  Top 1: Q7.1 72.54,82.26 74.5,80.2 R7.2
N$16
  Top 1: R8.2 75.58,82 Q8.1
N$17
  Top 1: PICO2.VSYS 123.11,10.71 122.2,9.8 D1.1
N$18
  Bottom 0.5: R9.2 111.2,54.6 111.7,54.1 118.2,54.1 119.37,55.27 LED2.1
N$19
  Top 1: R14.1 84.9,80.2 IC5.7
N$20
  Top 1: IC5.5 91.91,80.27 R15.1
N$21
  Bottom 0.5: IC14.10 23.35,26.75 22.4,27.7 22.4,43.2 23.81,44.61 IC15.9
N$22
  Top 0.5: IC15.10 25.15,47.15 25.9,47.9 25.9,58.1 25.4,58.6 24,58.6 23.1,59.5 23.1,63.9 24.11,64.91 IC16.9
N$23
  Bottom 0.5: IC16.10 23.55,67.45 22.2,68.8 22.2,84 23.41,85.21 IC17.9
N$24
  Top 0.5: Q15.3 100.24,57.24 97.3,54.3 R26.2
N$25
  Top 1: Q9.1 86.14,81.56 87.5,80.2 R14.2
N$26
  Top 1: R15.2 89.58,82 Q10.1
N$27
  Top 1: R16.1 98.1,80.2 IC6.7
N$28
  Top 1: IC6.5 105.11,80.27 R17.1
N$29
  Top 1: R16.2 101,80.2 99.84,81.46 Q11.1
N$30
  Top 1: R17.2 102.78,82 Q12.1
N$31
  Bottom 0.4: R33.2 104.3,49.5 107,46.8 110.3,46.8 111.54,48.04 Q16.2
N$32
  Top 0.5: D4.A 114.1,19.1 116.1,16.7 D3.C
N$33
  Bottom 1: Q13.3 103.7,18.6 105.6,16.7 109,16.7 111.5,14.2 R31.2
N$34  (via drill 0.45)
  Top 0.4: v122.1,20.3 122.1,28.5 119.5,31.1 119.5,33 118.4,34.1 118.4,36.8 115.5,39.7 115.5,44.11 R32.2
  Bottom 0.4: PICO2.3V3 124.07,18.33 v122.1,20.3
N$35
  Top 0.5: S2.3 117.34,47.9 | 117.34,47.9 S2.4 117.34,43.06 119.6,40.8 119.6,34.4 119.9,34.1 119.9,34.07 120.4,33.57 PICO2.RUN | Q16.3 116.54,48.7 117.34,47.9
  Bottom 0.5: R32.1 109.88,44.5 Q16.3
N$36  (via drill 0.45)
  Top 0.4: R34.1 63.43,33.84 PICO1.RUN 73.04,33.84 75.1,35.9 75.1,42.7 78.5,46.1 v78.5,54.9
  Bottom 0.4: v78.5,54.9 78.5,56.2 82.05,59.75 S1.3 S1.4
N$37
  Top 0.5: R10.2 109.8,56.8 108.8,55.8 108.8,53.9 110,52.7 113.1,52.7 115.31,54.91 LED2.3
N$38
  Top 0.5: R12.1 29.2,30.55 R13.2 38.99,32.29 40.69,34.09 JP3.2
N$45
  Top 0.5: R11.2 111.83,59 113.02,57.81 LED2.4
N$58
  Bottom 0.4: IC11.3 104.89,32.8 109.1,32.8 112.93,28.97 IC13.7 115.4,28.97 117.9,31.47 R20.1
N$59
  Top 0.4: IC13.2 105.17,28.97 103.3,27.1 103.3,25.69 R18.2 102.81,25.51
N$63
  Top 0.5: IC12.1 97.77,33.41 IC11.1
N$65
  Top 0.4: R21.2 105.8,23.3 IC13.4
N$68
  Top 0.4: IC13.3 107.03,26.43 108.74,28.14 IC11.5
OUT1
  Top 2.5: Q1.2 34.2,88.3 35.1,89.2 35.1,101.74 J4.1
OUT2
  Top 2.5: Q2.2 40.6,88.4 41.8,89.6 41.8,96.4 44.28,98.88 J4.3
OUT3
  Top 2.5: Q3.2 47.5,88.3 48.5,89.3 48.5,100.35 J4.4
OUT4
  Top 2.5: Q4.2 54.2,88.3 55.4,89.5 55.4,92.4 54,93.8 53.2,93.8 52.21,94.79 J4.5
OUT5
  Top 2.5: Q5.2 60.6,88.3 62.1,89.8 62.1,92.6 60.9,93.8 58.4,93.8 56.17,96.03 J4.6
OUT6
  Top 2.5: Q6.2 67.7,88.3 69,89.6 69,92.8 67.7,94.1 64.9,94.1 60.13,98.87 J4.7
OUT7
  Top 2.5: Q7.2 74.8,88.3 75.8,89.3 75.8,92.2 74.4,93.6 72.5,93.6 69,97.1 67.7,97.1 64.09,100.71 J4.8
OUT8
  Top 2.5: Q8.2 81.6,88.3 82.6,89.3 82.6,92.6 81.3,94 78.1,94 75.5,96.6 73.7,96.6 68.06,102.24 J4.9
OUT9
  Top 2.5: Q9.2 88.6,88.3 89.5,89.2 89.5,92.1 88.1,93.5 85.8,93.5 82.2,97.1 79.7,97.1 76.18,100.62 J3.1
OUT10
  Top 2.5: Q10.2 95.6,88.3 96.5,89.2 96.5,92.3 95.3,93.5 92,93.5 89,96.5 87.2,96.5 84.1,99.6 J3.3
OUT11
  Top 2.5: Q11.2 102.4,88.3 103,88.9 103,89 103.3,89.3 103.3,92.4 102,93.7 99.2,93.7 96.5,96.4 93.2,96.4 88.07,101.53 J3.4
OUT12
  Top 2.5: Q12.2 108.6,88.3 109.9,89.6 109.9,93.6 106.9,96.6 100.5,96.6 97.8,99.3 94.4,99.3 92.03,101.67 J3.5
OUTCTL1  (via drill 0.55)
  Top 0.5: v73.1,35.6 73.1,56.8 71,58.9 39.8,58.9 35.75,62.95 35,63.7 34.03,64.67 IC1.2
  Bottom 0.5: PICO1.GP8 74.86,33.84 v73.1,35.6
OUTCTL2  (via drill 0.55)
  Top 0.5: v74,37.8 74,57.3 71.6,59.7 45.3,59.7 40.8,64.2 40.4,64.6 39.11,65.89 IC1.4
  Bottom 0.5: PICO1.GP9 75.42,36.38 v74,37.8
OUTCTL3
  Top 0.5: IC2.2 47.23,67.17 53.8,60.6 75.2,60.6 81.64,54.16 PICO1.GP14
OUTCTL4
  Top 0.5: IC2.4 52.31,68.19 59,61.5 75.8,61.5 80.6,56.7 PICO1.GP15
OUTCTL5
  Top 0.5: 60.43,69.67 IC3.2 60.43,69.27 63.7,66 95.3,66 100.8,60.5 119.4,60.5 123.47,56.43 PICO2.GP16
OUTCTL6
  Top 0.5: IC3.4 65.51,68.99 67.6,66.9 95.7,66.9 101.1,61.5 119.9,61.5 122.9,58.5 126.9,58.5 128.3,57.1 128.3,55.2 126.99,53.89 PICO2.GP17
OUTCTL7
  Top 0.5: IC4.2 73.63,69.37 75.3,67.7 96.4,67.7 101.6,62.5 120.5,62.5 123.6,59.4 127.4,59.4 129.3,57.5 129.3,50.2 127.91,48.81 PICO2.GP18
OUTCTL8
  Top 0.5: IC4.4 78.71,69.69 79.9,68.5 97,68.5 102,63.5 121,63.5 124.1,60.4 127.9,60.4 130.3,58 130.3,49.4 127.17,46.27 PICO2.GP19
OUTCTL9
  Bottom 0.5: IC5.2 86.83,68.67 88.1,67.4 89.9,67.4 91.2,66.1 91.2,40.9 93.3,38.8 116.2,38.8 117.2,37.8 122.3,37.8 123.99,36.11 PICO2.GP22
OUTCTL10
  Bottom 0.5: IC5.4 92.1,69.94 92.1,41.3 93.5,39.9 114.7,39.9 115.9,41.1 126.22,41.1 PICO2.GP21
OUTCTL11
  Top 0.5: PICO2.GP20 127.23,43.73 131.3,47.8 131.3,58.5 128.4,61.4 124.7,61.4 121.6,64.5 102.7,64.5 100.03,67.17 IC6.2
OUTCTL12
  Top 0.5: PICO2.GP28_A2 127.31,23.41 132.2,28.3 132.2,59 128.9,62.3 125.3,62.3 122.2,65.4 106.4,65.4 105.11,66.69 IC6.4
PLUNGER_ADC  (via drill 0.6)
  Top 0.4: 58.91,22.78 58.68,22.78
  Top 0.5: JP3.5 48.31,30.29 55.82,22.78 55.98,22.78 | PICO1.GP28_A2 63.78,23.68 62.88,22.78 58.91,22.78 55.98,22.78 | 55.98,22.78 v55.3,22.1
  Bottom 0.5: J9.8 50.32,17.12 v55.3,22.1
PLUNGER_IRQ1_SCL
  Top 0.4: PICO1.GP13 82.88,49.08 75.7,41.9 75.7,12 66.7,3 56.4,3 54,5.4 54,11.1 51.7,13.4 48.7,13.4 47.78,12.48 J9.6
PLUNGER_IRQ2
  Bottom 0.5: PICO1.GP27_A1 63.26,28.76 57.7,23.2 57.7,19.1 52.6,14 52.6,8.2 50.9,6.5 48.8,6.5 47.8,7.5 47.8,8.6 47.78,8.62 J9.5
PLUNGER_SDA
  Top 0.4: PICO1.GP12 82.84,46.54 78.1,41.8 78.1,10.1 69.2,1.2 49.9,1.2 42.7,8.4 J9.1
PSU2_STATUS_SENSE  (via drill 0.55)
  Top 0.5: R22.2 116.9,30.8 116.9,35.4 v117.1,35.6
  Bottom 0.5: R22.2 118.2,26.3 115.79,23.89 IC13.5 | v117.1,35.6 117.1,36.2 115.5,37.8 92.8,37.8 90.2,40.4 90.2,42 88.2,44 PICO1.GP11
PSU2_STATUS_SET  (via drill 0.55)
  Top 0.5: v103.6,36.8 103.6,36.7 105,35.3 105,32.9 IC13.1
  Bottom 0.5: PICO1.GP10 88.34,41.46 89.1,40.7 89.1,40.2 92.5,36.8 | 92.5,36.8 92.9,36.4 | 92.5,36.8 v103.6,36.8
SCL  (via drill 0.45)
  Top 0.4: JP2.4 45.87,41.17 44.5,39.8 44.5,27.7 43.3,26.5 43.3,23.17 JP4.3 43.23,21.37 45.6,19 v63.3,19 62.4,19.9 R30.1 | v63,12.5 62.2,11.7 QWIIC1.4 62.2,8.6 v63.1,7.7 | PICO1.GP7 85.2,31.3 81.7,27.8 81.7,7.4 v85,4.1 85.9,3.2 110.3,3.2 111.5,2 v124.3,2 145.2,2 150.1,6.9 150.1,21.4 153.9,25.2 153.9,30.6 152.22,32.28 J14.3
  Top 0.5: JP5.6 47.51,46.31 45.87,44.67 JP2.4
  Bottom 0.4: v63.3,19 63.6,18.7 63.6,13.1 v63,12.5 | PICO2.GP27_A1 127.51,28.49 129,27 129,6.7 v124.3,2 | v85,4.1 66.7,4.1 v63.1,7.7
SDA  (via drill 0.45, 0.5)
  Top 0.4: JP2.5 48.41,39.41 47.05,38.05 47.05,26.55 45.77,25.27 JP4.4 45.77,21.53 46.6,20.7 59.5,20.7 59.7,20.5 | v61.1,10.6 61.2,10.5 QWIIC1.3 61.1,8.91 v61.1,7.7 | PICO1.GP6 85.26,28.76 83.3,26.8 83.3,7 85,5.3 89.2,5.3 | J14.5 148.1,34.76 148.1,7.8 144.5,4.2 v129,4.2 117.2,4.2 114.2,7.2 104.5,7.2 102.6,5.3 89.2,5.3 | 89.2,5.3 v87.9,4 | 59.7,20.5 v60.3,19.9 | R29.1 59.7,20.5
  Top 0.5: JP2.5 48.41,44.11 50.05,45.75 JP5.7
  Bottom 0.4: JP4.4 45.77,21.77 | v60.3,19.9 61.1,19.1 v61.1,10.6 | PICO1.GP6 87.94,28.76 94.7,22 115.6,22 119.8,26.2 119.8,29 121.83,31.03 PICO2.GP26_A0 127.47,31.03 130.4,28.1 130.4,5.6 v129,4.2 | v87.9,4 86.3,2.4 63.1,2.4 61.1,4.4 v61.1,7.7
UART0_RX
  Top 0.406: J12.3 62.46,50.96 65.66,54.16 PICO1.GP17
UART0_TX
  Top 0.4: 62.26,56.6 J12.1
  Top 0.406: PICO1.GP16 63.16,56.7 62.26,56.6
VBUS
  Top 1: D1.2 109.3,5.7 111.8,3.2 145,3.2 149.1,7.3 149.1,25.6 J14.1
  Bottom 1: PICO1.VBUS 70.06,8.44 73.4,5.1 107.5,5.1 D1.2

## Text on the board
tPlace: RESET | UART | TX | GND | LIS3DH/MMA8451Q / Module | RX | RESET | ADS1115 / Module
tNames: 1 | FLASHERS | 8 | 1 | X | 2 | 3 | 4 | 5 | 6 | 7 | 8 | 9 | X | 10 | 11 | 12 | GND | GND | GND | GND | 12V | 5V | HIGH POWER OUTPUTS 1-8 | HI PWR 9-12 | 2ND PSU | 9 | 10 | 11 | 12 | 13 | 14 | 15 | 5V | GND | 32 | 31 | 30 | X | 29 | BUTTONS 25-32 | 28 | 27 | 26 | 25 | GND | 24 | PINSCAPE PICO | 23 | DIY MAIN BOARD REV 20250603 | + | 22 | 21 | GND/STROBE | + | X | BUTTONS 17-24 | 20 | 19 | 18 | 17 | GND | 16 | TO POWER BOARD | 15 | 14 | 13 | 12 | BUTTONS 9-16 | X | 11 | 10 | 9 | PLUNGER | IR-RX | IR-TX | BUTTONS 1-8 | GND | 8 | 7 | 6 | 5 | 4 | 3 | X | 2 | 1 | QWIIC | MAIN PICO | PWMWORKER 0